# EAGLE design Controller v1 (EAGLE 9.5.0)
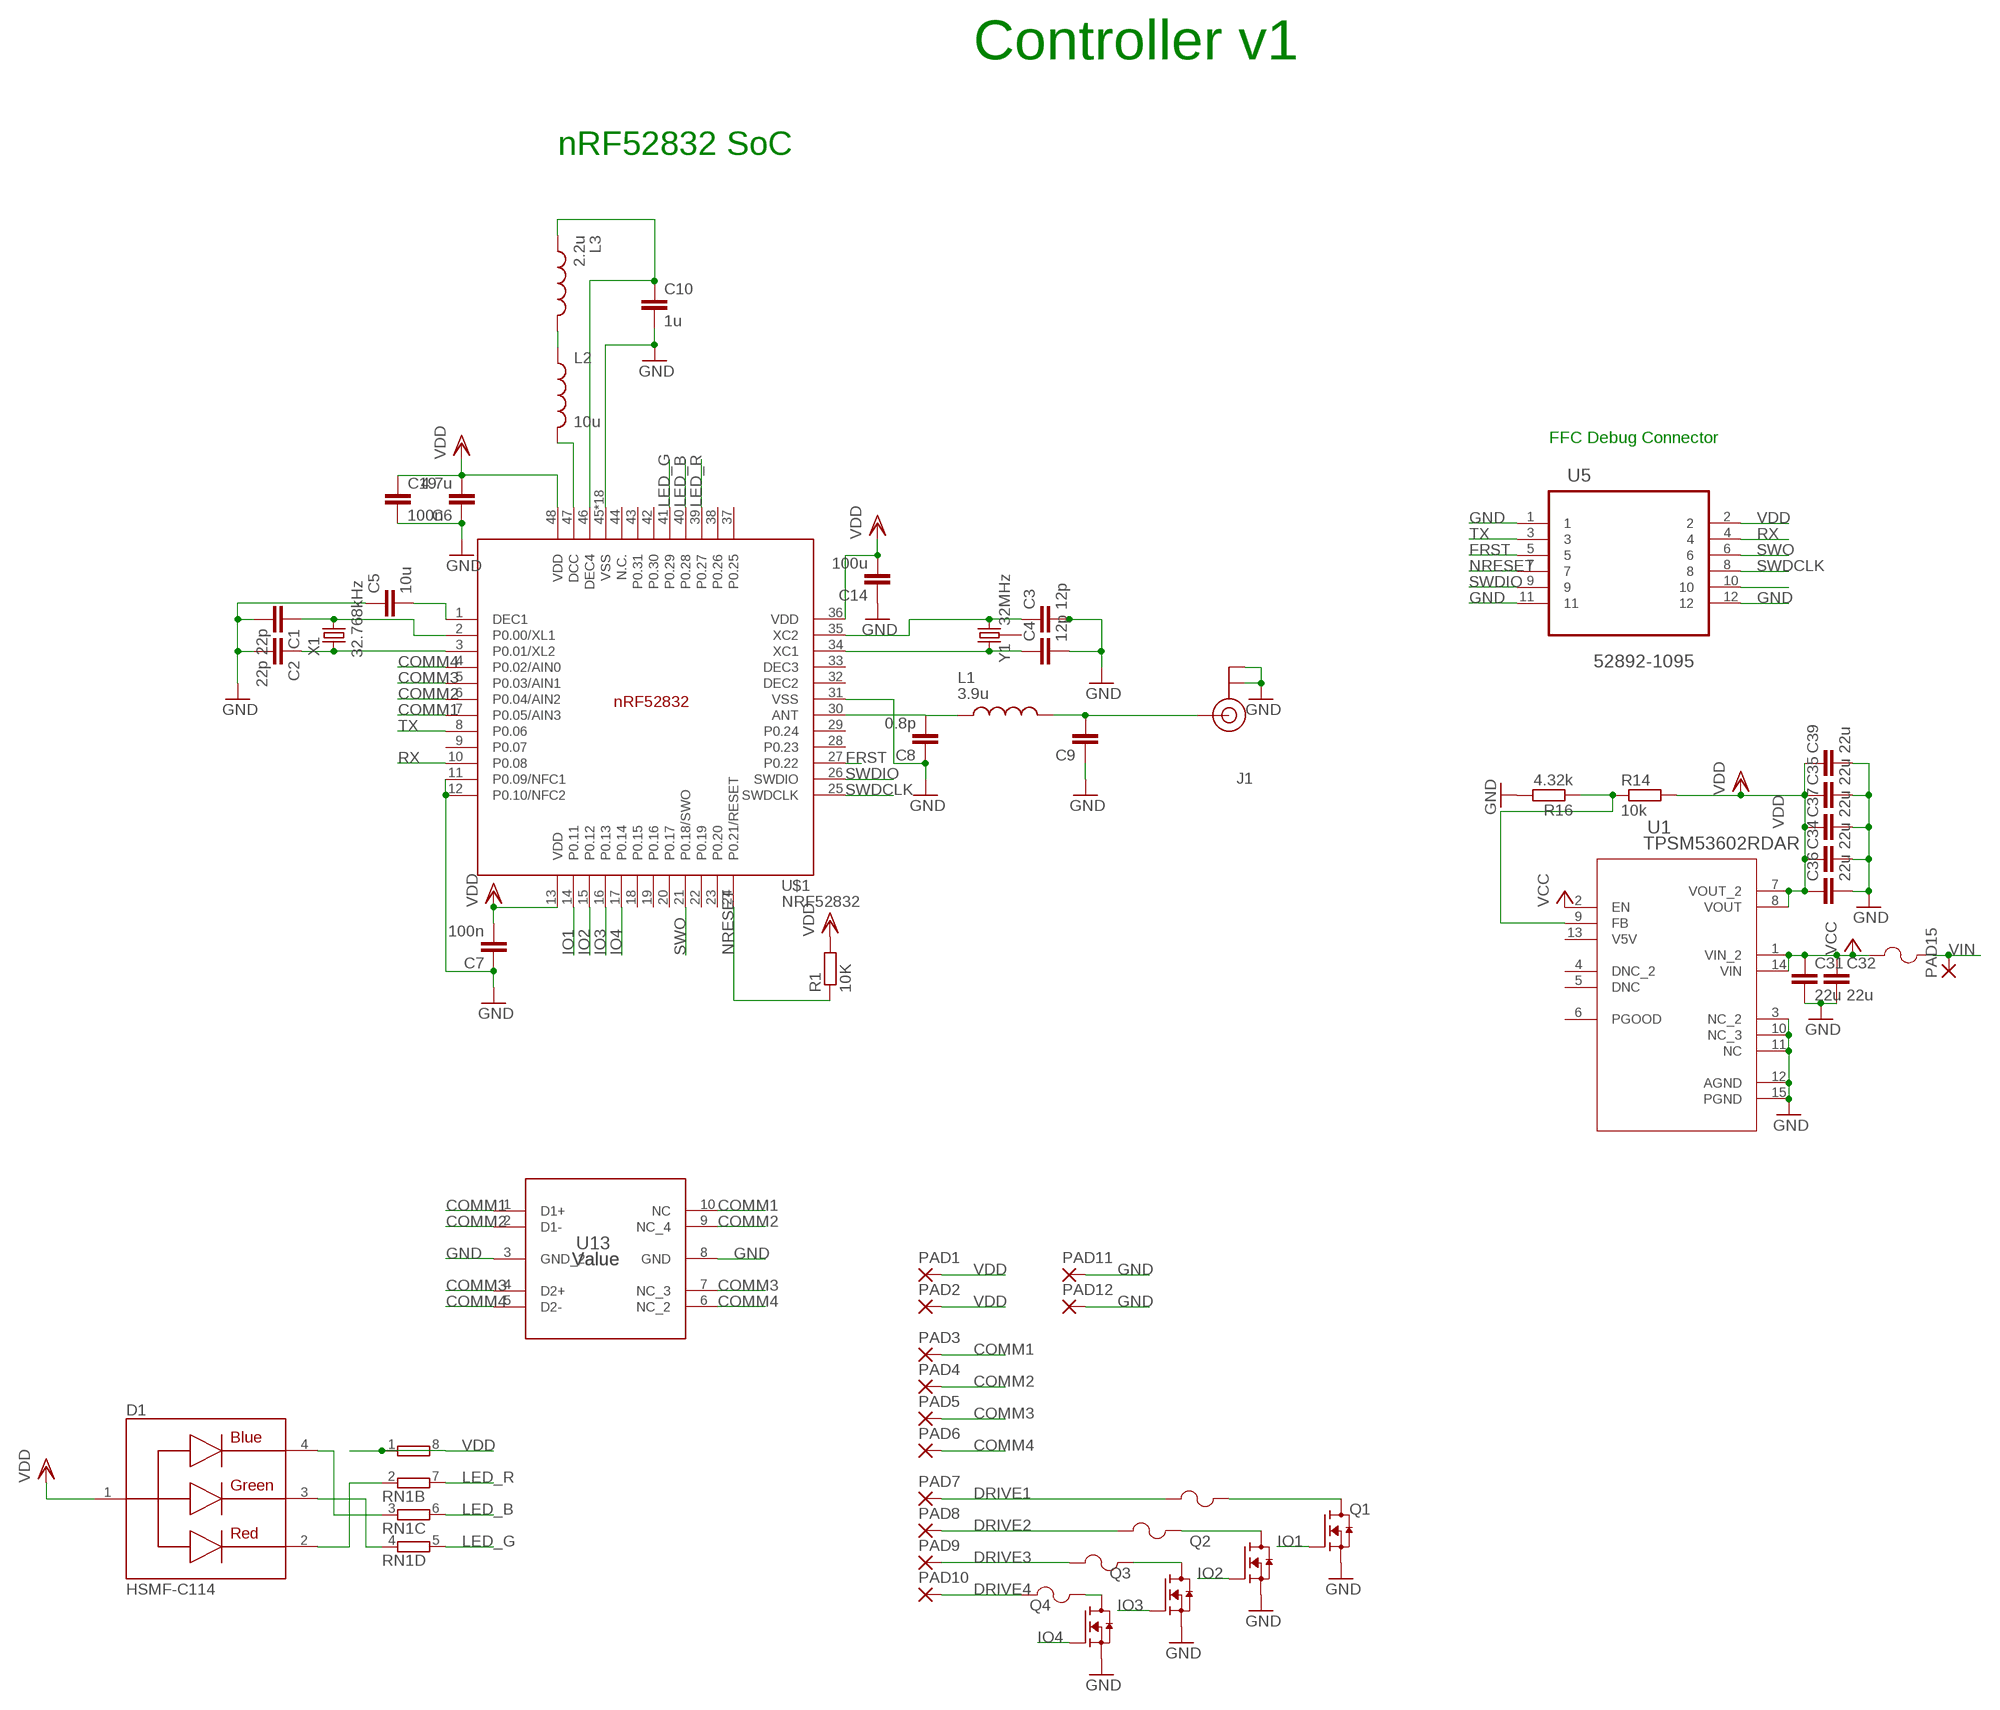
[diagram p0: schematic, sheet 1]

## Parts
C1  22p  CC0402  [C0402]
C2  22p  CC0402  [C0402]
C3  12p  CC0402  [C0402]
C4  12p  CC0402  [C0402]
C5  10u  CC0402  [C0402]
C6  4.7u  CC0402  [C0402]
C7  100n  CC0603R  [C0603R]
C8  0.8p  CC0402  [C0402]
C9  1.2p  CC0402  [C0402]
C10  1u  CC0402  [C0402]
C14  100u  CC0402  [C0402]
C19  100n  CC0402  [C0402]
C31  22u  CC0603R  [C0603R]
C32  22u  CC0603R  [C0603R]
C34  22u  CC0603R  [C0603R]
C35  22u  CC0603R  [C0603R]
C36  22u  CC0603R  [C0603R]
C37  22u  CC0603R  [C0603R]
C39  22u  CC0603R  [C0603R]
D1  HSMF-C114  [DIOSC160X150X35-4N]
F1  1210L050YR1210LSERIES_LTF-L  [1210LSERIES_LTF-L]
F2  1210L050YR1210LSERIES_LTF-L  [1210LSERIES_LTF-L]
F3  1210L050YR1210LSERIES_LTF-L  [1210LSERIES_LTF-L]
F4  1210L050YR1210LSERIES_LTF-L  [1210LSERIES_LTF-L]
F5  1210L050YR1210LSERIES_LTF-L  [1210LSERIES_LTF-L]
J1  U.FL  [U.FL]
L1  3.9u  MHQ0402P7N5JT000  [INDC0402X26N]
L2  10u  INDUCTOR  [L0603]
L3  2.2u  MHQ0402P7N5JT000  [INDC0402X26N]
PAD1  2,54/1,1  [2,54/1,1]
PAD2  2,54/1,1  [2,54/1,1]
PAD3  2,54/1,1  [2,54/1,1]
PAD4  2,54/1,1  [2,54/1,1]
PAD5  2,54/1,1  [2,54/1,1]
PAD6  2,54/1,1  [2,54/1,1]
PAD7  2,54/1,1  [2,54/1,1]
PAD8  2,54/1,1  [2,54/1,1]
PAD9  2,54/1,1  [2,54/1,1]
PAD10  2,54/1,1  [2,54/1,1]
PAD11  2,54/1,1  [2,54/1,1]
PAD12  2,54/1,1  [2,54/1,1]
PAD15  2,54/1,1  [2,54/1,1]
Q1  CSD16301Q2  [TRANS_CSD16301Q2]
Q2  CSD16301Q2  [TRANS_CSD16301Q2]
Q3  CSD16301Q2  [TRANS_CSD16301Q2]
Q4  CSD16301Q2  [TRANS_CSD16301Q2]
R1  10K  RR0402  [R0402]
R14  10k  RR0402  [R0402]
R16  4.32k  RR0402  [R0402]
RN1  4R-N0402ARV341  [4X0402ARV341]
U1  TPSM53602RDAR  [B3QFN15_RDA_TEX]
U5  52892-1095  [MOLEX_52892-1095]
U13  Value  ESD204DQAR  [DQA0010A]
U$1  NRF52832  [QFN40P600X600X90-48_N]
X1  32.768kHz  ABS07-32.768KHZ-T  [ABS07-32.768KHZ-T]
Y1  32MHz  CRYSTAL-26MHZSMD-3.2X2.5  [CRYSTAL-SMD-3.2X2.5MM]

## Nets
COMM1: PAD3.1(P) U13.1(D1+) U13.10(NC) U$1.7(P0.05/AIN3)
COMM2: PAD4.1(P) U13.2(D1-) U13.9(NC_4) U$1.6(P0.04/AIN2)
COMM3: PAD5.1(P) U13.4(D2+) U13.7(NC_3) U$1.5(P0.03/AIN1)
COMM4: PAD6.1(P) U13.5(D2-) U13.6(NC_2) U$1.4(P0.02/AIN0)
DRIVE1: F5.1 PAD7.1(P)
DRIVE2: F4.1 PAD8.1(P)
DRIVE3: F2.1 PAD9.1(P)
DRIVE4: F3.1 PAD10.1(P)
FRST: U5.5 U$1.27(P0.22)
GND: C1.2 C2.2 C3.2 C4.2 C5.1 C6.1 C7.1 C8.1 C9.1 C10.2 C14.1 C19.2 C31.2 C32.2 C34.2 C35.2 C36.2 C37.2 C39.2 J1.1(GND) J1.2(GND) PAD11.1(P) PAD12.1(P) Q1.4(S) Q1.7(S) Q2.4(S) Q2.7(S) Q3.4(S) Q3.7(S) Q4.4(S) Q4.7(S) R16.2 U1.3(NC_2) U1.10(NC_3) U1.11(NC) U1.12(AGND) U1.15(PGND) U5.1 U5.11 U5.12 U13.3(GND_2) U13.8(GND) U$1.11(P0.09/NFC1) U$1.12(P0.10/NFC2) U$1.31(VSS) U$1.45(VSS) U$1.PAD(VSS) U$1.PAD@VIA01(VSS) U$1.PAD@VIA02(VSS) U$1.PAD@VIA03(VSS) U$1.PAD@VIA04(VSS) U$1.PAD@VIA05(VSS) U$1.PAD@VIA06(VSS) U$1.PAD@VIA07(VSS) U$1.PAD@VIA08(VSS) U$1.PAD@VIA09(VSS) U$1.PAD@VIA10(VSS) U$1.PAD@VIA11(VSS) U$1.PAD@VIA12(VSS) U$1.PAD@VIA13(VSS) U$1.PAD@VIA14(VSS) U$1.PAD@VIA15(VSS) U$1.PAD@VIA16(VSS)
IO1: Q1.3(G) U$1.14(P0.11)
IO2: Q2.3(G) U$1.15(P0.12)
IO3: Q3.3(G) U$1.16(P0.13)
IO4: Q4.3(G) U$1.17(P0.14)
LED_B: RN1.6 U$1.40(P0.28)
LED_G: RN1.5 U$1.41(P0.29)
LED_R: RN1.7 U$1.39(P0.27)
N$1: C1.1 U$1.2(P0.00/XL1) X1.2
N$2: C2.1 U$1.3(P0.01/XL2) X1.1
N$3: C3.1 U$1.35(XC2) Y1.3
N$4: C4.1 U$1.34(XC1) Y1.1
N$5: C5.2 U$1.1(DEC1)
N$6: C8.2 L1.1 U$1.30(ANT)
N$7: F2.2 Q3.1(D) Q3.2(D) Q3.5(D) Q3.6(D) Q3.8(D)
N$8: F3.2 Q4.1(D) Q4.2(D) Q4.5(D) Q4.6(D) Q4.8(D)
N$9: L2.2 U$1.47(DCC)
N$10: L2.1 L3.2
N$11: C10.1 L3.1 U$1.46(DEC4)
N$16: D1.2 RN1.2
N$17: D1.3 RN1.4
N$18: D1.4 RN1.3
N$20: F4.2 Q2.1(D) Q2.2(D) Q2.5(D) Q2.6(D) Q2.8(D)
N$21: U5.10
N$22: F5.2 Q1.1(D) Q1.2(D) Q1.5(D) Q1.6(D) Q1.8(D)
N$32: R14.1 R16.1 U1.9(FB)
NRESET: R1.1 U5.7 U$1.24(P0.21/RESET)
RF: C9.2 J1.FEED(SIGNAL) L1.2
RX: U5.4 U$1.10(P0.08)
SWDCLK: U5.8 U$1.25(SWDCLK)
SWDIO: U5.9 U$1.26(SWDIO)
SWO: U5.6 U$1.21(P0.18/SWO)
TX: U5.3 U$1.8(P0.06)
VCC: C31.1 C32.1 F1.1 U1.1(VIN_2) U1.2(EN) U1.14(VIN)
VDD: C6.2 C7.2 C14.2 C19.1 C34.1 C35.1 C36.1 C37.1 C39.1 D1.1 PAD1.1(P) PAD2.1(P) R1.2 R14.2 RN1.1 RN1.8 U1.7(VOUT_2) U1.8(VOUT) U5.2 U$1.13(VDD) U$1.36(VDD) U$1.48(VDD)
VIN: F1.2 PAD15.1(P)
Unconnected: U1.4(DNC_2) U1.5(DNC) U1.6(PGOOD) U1.13(V5V) U$1.9(P0.07) U$1.18(P0.15) U$1.19(P0.16) U$1.20(P0.17) U$1.22(P0.19) U$1.23(P0.20) U$1.28(P0.23) U$1.29(P0.24) U$1.32(DEC2) U$1.33(DEC3) U$1.37(P0.25) U$1.38(P0.26) U$1.42(P0.30) U$1.43(P0.31) U$1.44(N.C.) Y1.2 Y1.4

## Notes on the sheet
- Controller v1
- nRF52832 SoC
- FFC Debug Connector

## Library data of the parts
C1-C6 C8-C10 C14 C19 = eagle-ltspice:C: CAPACITOR, European symbol; SPICEMODEL: NONE; SPICEPREFIX: C
C7 C31 C32 C34-C37 C39 = eagle-ltspice:C: CAPACITOR, European symbol
D1 = HSMF-C114:HSMF-C114: LED Tri-Color Blue/Green/Red 468nm/523nm/637nm 4-Pin Chip LED T/R; AVAILABILITY: Unavailable; DESCRIPTION: LED RGB DIFFUSED CHIP SMD; MF: Broadcom Limited; MP: HSMF-C114; PACKAGE: 0606 Broadcom; PRICE: None
F1-F5 = 1210 FUSE:1210L050YR; BUILT_BY: EMA_UL_Team; MANUFACTURER_PART_NUMBER: 1210L050YR; SOURCELIBRARY: LittleFuse_2015-04-13; VENDOR: Littelfuse Inc
J1 = SparkFun-Connectors:U.FL: SMD Antenna Connector - U.FL 2mm height, 3.0mm x 3.0mm receptacle size. SparkFun Products: SparkFun WiFi Shield - ESP8266 <https://www.sparkfun.com/products/13287> SparkFun ESP8266 Thing <https://www.sparkfun.com/products/13231> SparkFun MiniGen - Pro Mini Signal Generator Shield <https://www.sparkfun.com/products/11420>; PROD_ID: CONN-09193; SF_ID: WRL-09144
L1 L3 = MHQ0402P7N5JT000:MHQ0402P7N5JT000: 221 NH 5% GOLD TERMINAL; AVAILABILITY: Unavailable; DESCRIPTION: FIXED IND 7.5NH 200MA 1.2 OHM; MF: TDK; MP: MHQ0402P7N5JT000; PACKAGE: 0402 TDK; PRICE: None
L2 = BeagleBone_Blue_R3:INDUCTOR: Inductors Basic Inductor/Choke - 0603 and 1206. Footprints are not proven and vary greatly between part numbers. SRN6045- 33uH, 20% 1.4A
PAD1-PAD12 PAD15 = wirepad:2,54/1,1: THROUGH-HOLE PAD
Q1-Q4 = CSD16301Q2:CSD16301Q2: N-Channel 25V 5A (Tc) 2.3W (Ta) Surface Mount 6-SON Check prices <https://snapeda.com/parts/CSD16301Q2/Texas%20Instruments/view-part/?ref=eda>; ARROW_ELECTRONICS-PURCHASE-URL: https://snapeda.com/shop?store=Arrow+Electronics&id=49184; AVAILABILITY: Good; DESCRIPTION: 25V, N ch NexFET MOSFET, single SON2x2, 29mOhm 6-WSON -55 to 150; DIGIKEY-PURCHASE-URL: https://snapeda.com/shop?store=DigiKey&id=49184; MF: Texas Instruments; MOUSER-PURCHASE-URL: https://snapeda.com/shop?store=Mouser&id=49184; MP: CSD16301Q2; PACKAGE: WSON-6 Texas Instruments; PRICE: None; TEXAS_INSTRUMENTS-PURCHASE-URL: https://snapeda.com/shop?store=Texas+Instruments&id=49184
R1 R14 R16 = eagle-ltspice:R: RESISTOR, European symbol; SPICEMODEL: NONE; SPICEPREFIX: R
RN1 = resistor-dil:4R-N: Array Chip Resistor Source: RS Component / Phycomp; OC_FARNELL: unknown; OC_NEWARK: unknown
U1 = TPSM53602:TPSM53602RDAR; BUILT_BY: EMA_Cory; COPYRIGHT: Copyright (C) 2018 Accelerated Designs. All rights reserved; DATASHEET: https://www.ti.com/lit/ds/symlink/tpsm53602.pdf?ts=1593032137197&ref_url=https%253A%252F%252Fwww.ti.com%252Fstore%252Fti%252Fen%252Fp%252Fproduct%252F%253Fp%253DTPSM53602RDAR; MANUFACTURER_PART_NUMBER: TPSM53602RDAR; SOURCELIBRARY: TI_2020-06-27; VENDOR: Texas Instruments
U5 = 52892-1095:52892-1095: CONNECTOR, FPC, ZIF, 0.50MM, 10 WAY; AVAILABILITY: Unavailable; DESCRIPTION: Socket, r/a, Fpc, Zif, Smt, 10way; MF: Molex; MP: 52892-1095; PACKAGE: None; PRICE: None
U13 = ESD204DQAR:ESD204DQAR; MANUFACTURER: Texas Instruments; PARTNUMBER: ESD204DQAR; REFDES: RefDes; TYPE: TYPE
U$1 = Nordic_nRF:NRF52832: nRF52832 Features Single chip, highly flexible, 2.4 GHz multi-protocol SoC 32-bit ARM Cortex-M4F Processor 1.7v to 3.6v operation 512kB flash + 64kB RAM Supports concurrent Bluetooth Smart/ANT protocol operation On-chip NFC tag for Out-of-Band (OOB) pairing Up to +4dBm output power -96dBm sensitivity, Bluetooth Smart Thread safe and run-time protected Event driven API On air compatible with nRF24L and nRF24AP series 2 data rates (2Mbps/1Mbps) PPI - maximum flexibility for power-efficient applications and code simplification Automated power management system with automatic power management of each peripheral Configurable I/O mapping for analog and digital I/O 3 x Master/Slave SPI 2 x Two-wire interface (I²C) UART (RTS/CTS) 3 x PWM AES HW encryption Real Time Counter (RTC) Digital microphone interface (PDM) On-chip balun Applications Internet of Things (IoT) Wearables SmartHome sensors Connected white goods Computer peripherals Voice-command smart remotes A4WP ‘Rezence’ wireless charging Beacons Sports and fitness sensors and hubs Connected health products Smart watches RC Toys Interactive games Building automation and sensor networks
X1 = Crystals:ABS07-32.768KHZ-T: CRYSTAL 32.7680KHZ 12.5PF SMD Manufacturer's datasheet <https://abracon.com/Resonators/ABS07.pdf>; CREATED_BY: PCBLayout.com; DIGIKEY_PART_NUMBER: 535-9542-2-ND; MANUFACTURER: Abracon LLC; MPN: ABS07-32.768KHZ-T; PACKAGE: SMD-2
Y1 = SparkFun-Clocks:CRYSTAL-26MHZ: 26MHz Crystal w/ Ground Pin Digikey Example <http://www.digikey.com/product-detail/en/epson/TSX-3225%2026.0000MF09Z-AC3/SER3627CT-ND/1802878> Frequency: 26MHz Frequency Stability: ±9ppm Frequency Tolerance: ±10ppm Load Capacitance: 9pF SparkFun Products: SparkFun ESP32 Thing <https://www.sparkfun.com/products/13907> SparkFun ESP8266 Thing Dev Board <https://www.sparkfun.com/products/13711>; PROD_ID: XTAL-12454

## Net classes
1 RF: clearance 0.4 mm

## Board
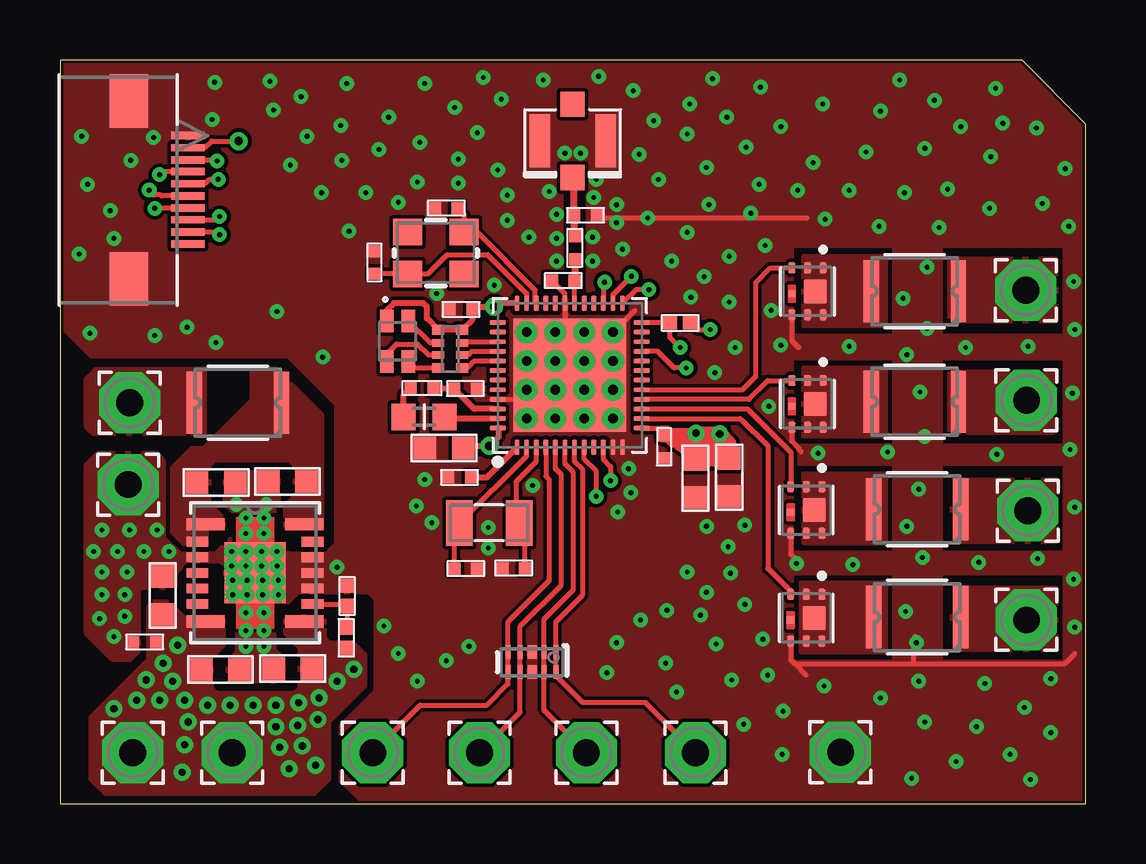
[diagram p1: board, top side]
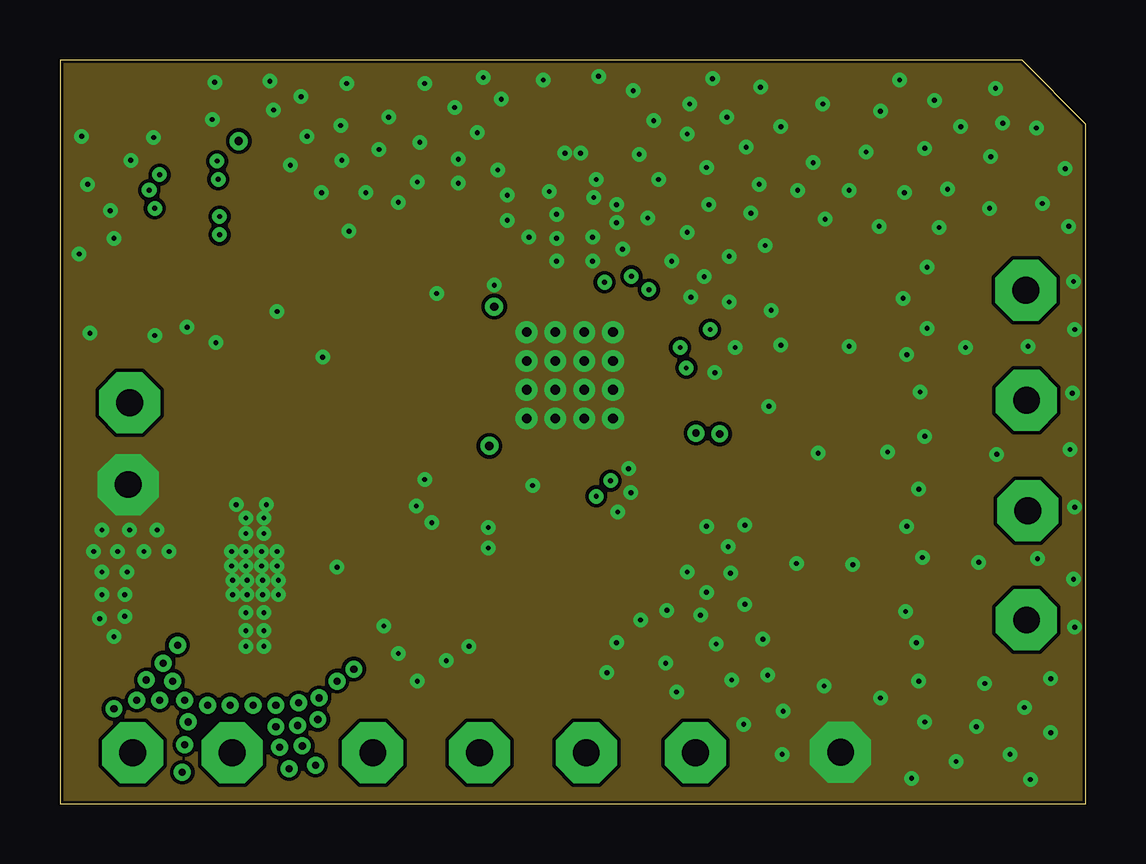
[diagram p2: board, inner layer Route2]
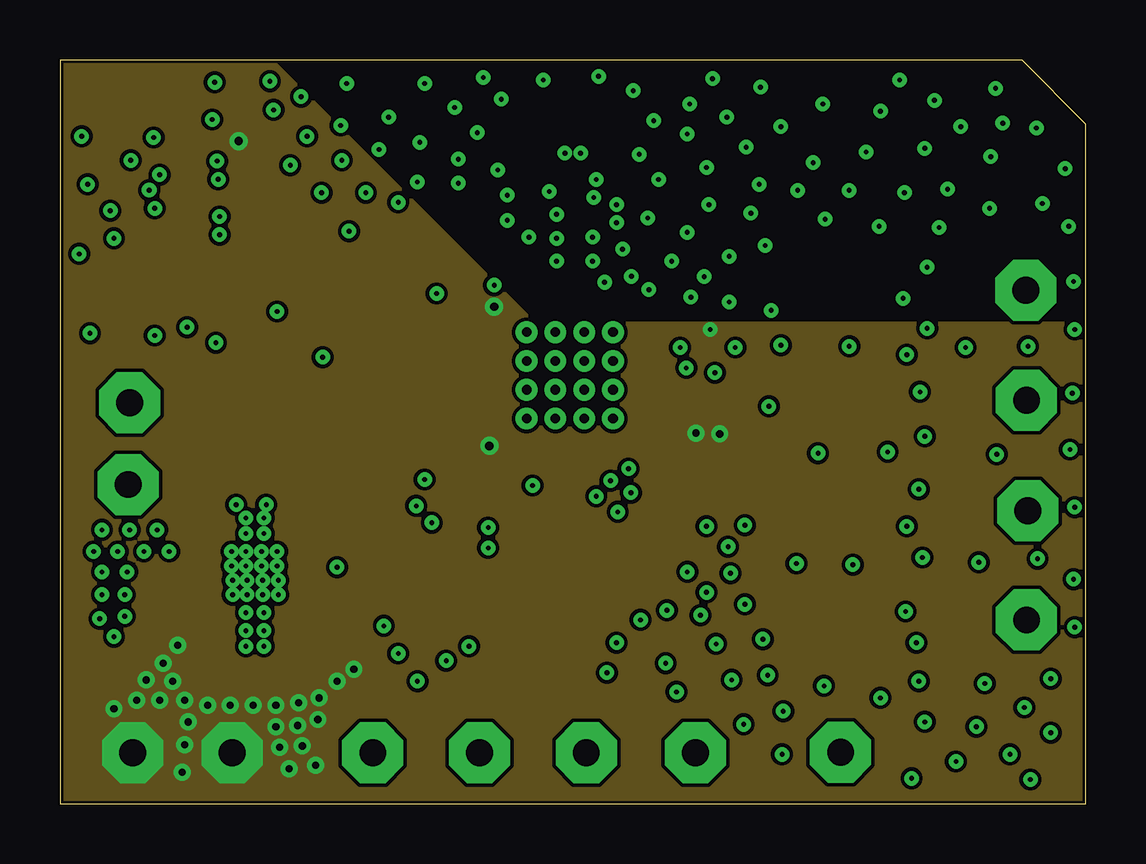
[diagram p3: board, inner layer Route15]
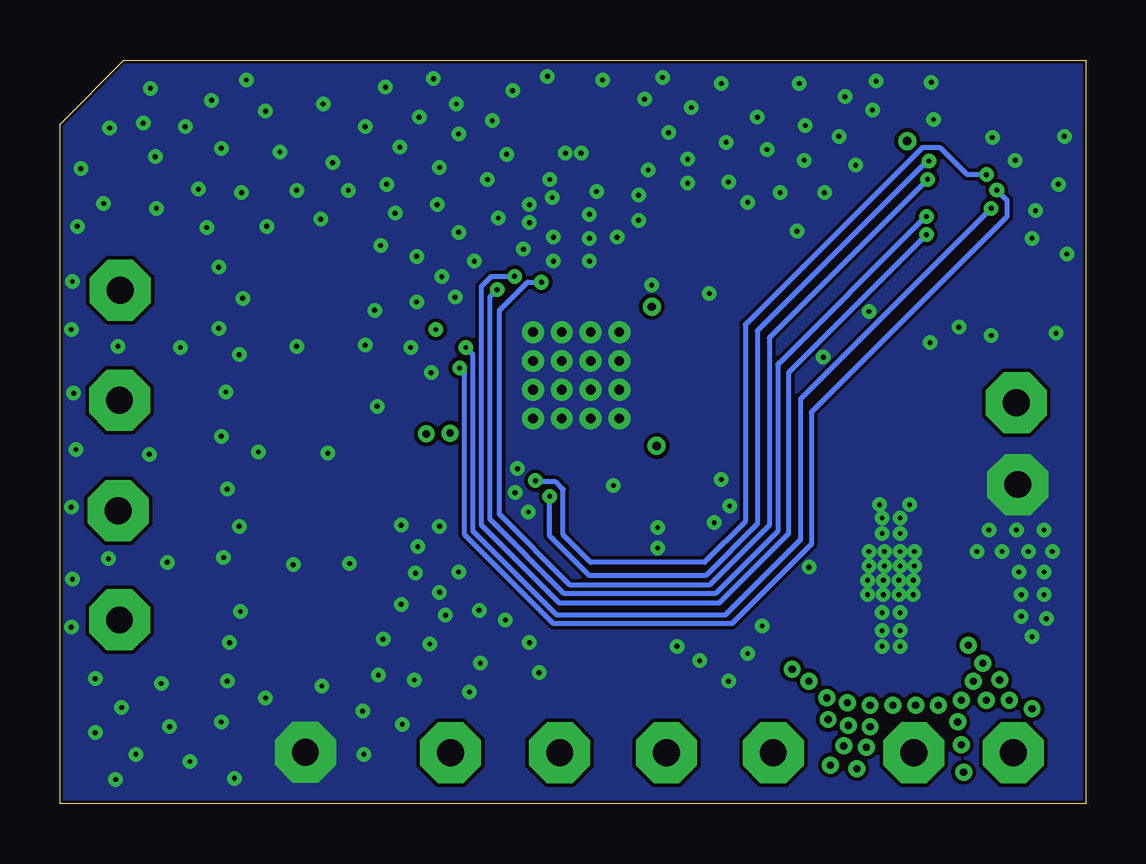
[diagram p4: board, bottom side, seen from below]

Size 42.77 x 30.98 mm. Coordinates in mm from the lower left corner, seen from the top.
Outline: 0,0 42.77,0 42.77,28.31 40.11,30.98 0,30.98 0,0
Copper layers (1+2*15+16): Top 0.035mm / dielectric 1.5mm / Route2 0.035mm / dielectric 0.15mm / Route15 0.035mm / dielectric 0.2mm / Bottom 0.035mm
Design rules "default *": minimum track width 5mil, minimum drill 0.2mm, track to track 6mil, track to pad 6mil, pad to pad 6mil, via to via 6mil, smd to smd 6mil, copper to edge 5mil, drill to drill 6mil, minimum pad ring 10mil, minimum via ring 8mil, stop-mask expansion 0mil, vias tented up to drill 40mil, thermal gap 0mil
tRestrict: area 20.1,21.1 to 21.1,22.1; 2 lines

### Footprints (pad centres in the part's own frame; a part is rotated, then mirrored left to right if it is on the bottom)
C0402 = smd 0.5 x 0.5: 1 -0.475,0; 2 0.475,0
C0603R = smd 0.95 x 0.95: 1 -0.85,0; 2 0.75,0
DIOSC160X150X35-4N = smd 0.94 x 0.57: 1 -0.845,-0.45; 2 -0.845,0.45; 3 0.845,0.45; 4 0.845,-0.45
1210LSERIES_LTF-L = smd 0.635 x 2.591: 1 -1.816,0; 2 1.816,0
U.FL = smd 2.2 x 0.85: 1 0,1.375; 2 0,-1.375 | smd 1.05 x 1: FEED 1.525,0; NC -1.525,0
INDC0402X26N = smd 0.5 x 0.5: 1 -0.732,0; 2 0.232,0
L0603 = smd 1 x 1.1: 1 -0.85,0; 2 0.85,0
2,54/1,1 = drill 1.118 pad 2.54 octagon: 1 0,0
TRANS_CSD16301Q2 = smd 0.45 x 0.3: 1 -0.975,0.65; 2 -0.975,0; 3 -0.975,-0.65; 4 0.975,-0.65; 5 0.975,0; 6 0.975,0.65 | smd 0.3 x 0.3: 7 0.095,-0.65 | smd 1 x 0.95: 8 0,0.325
R0402 = smd 0.6 x 0.55: 1 -0.425,0; 2 0.425,0
4X0402ARV341 = smd 0.4 x 0.5: 1 -0.8,-0.5; 4 0.8,-0.5; 5 0.8,0.5; 8 -0.8,0.5 | smd 0.3 x 0.5: 2 -0.25,-0.5; 3 0.25,-0.5; 6 0.25,0.5; 7 -0.25,0.5
B3QFN15_RDA_TEX = smd 1.6 x 0.508: 1 -2.057,2.025; 7 -2.057,-2.025; 8 2.057,-2.025; 14 2.057,2.025 | smd 0.914 x 0.406: 2 -2.4,1.3; 3 -2.4,0.65; 4 -2.4,0; 5 -2.4,-0.65; 6 -2.4,-1.3; 9 2.4,-1.3; 10 2.4,-0.65; 11 2.4,0; 12 2.4,0.65; 13 2.4,1.3 | smd 2.54 x 2.54: 15 0,0
MOLEX_52892-1095 = smd 0.305 x 1.397: 1 2.261,2.896; 2 1.753,2.896; 3 1.245,2.896; 4 0.762,2.896; 5 0.254,2.896; 6 -0.254,2.896; 7 -0.762,2.896; 8 -1.245,2.896; 9 -1.753,2.896; 10 -2.261,2.896 | smd 2.21 x 1.6: 11 -3.702,5.359; 12 3.702,5.359
DQA0010A = smd 0.565 x 0.2: 1 -0.417,1; 2 -0.417,0.5; 4 -0.417,-0.5; 5 -0.417,-1; 6 0.417,-1; 7 0.417,-0.5; 9 0.417,0.5; 10 0.417,1 | smd 0.565 x 0.4: 3 -0.417,0; 8 0.417,0
QFN40P600X600X90-48_N = smd 0.65 x 0.2: 1 -3,2.2; 2 -3,1.8; 3 -3,1.4; 4 -3,1; 5 -3,0.6; 6 -3,0.2; 7 -3,-0.2; 8 -3,-0.6; 9 -3,-1; 10 -3,-1.4; 11 -3,-1.8; 12 -3,-2.2; 25 3,-2.2; 26 3,-1.8; 27 3,-1.4; 28 3,-1; 29 3,-0.6; 30 3,-0.2; 31 3,0.2; 32 3,0.6; 33 3,1; 34 3,1.4; 35 3,1.8; 36 3,2.2 | smd 0.2 x 0.65: 13 -2.2,-3; 14 -1.8,-3; 15 -1.4,-3; 16 -1,-3; 17 -0.6,-3; 18 -0.2,-3; 19 0.2,-3; 20 0.6,-3; 21 1,-3; 22 1.4,-3; 23 1.8,-3; 24 2.2,-3; 37 2.2,3; 38 1.8,3; 39 1.4,3; 40 1,3; 41 0.6,3; 42 0.2,3; 43 -0.2,3; 44 -0.6,3; 45 -1,3; 46 -1.4,3; 47 -1.8,3; 48 -2.2,3 | smd 4.7 x 4.7: PAD 0,0 | drill 0.4: PAD@VIA01 -1.8,1.8; PAD@VIA02 -1.8,0.6; PAD@VIA03 -1.8,-0.6; PAD@VIA04 -1.8,-1.8; PAD@VIA05 -0.6,1.8; PAD@VIA06 -0.6,0.6; PAD@VIA07 -0.6,-0.6; PAD@VIA08 -0.6,-1.8; PAD@VIA09 0.6,1.8; PAD@VIA10 0.6,0.6; PAD@VIA11 0.6,-0.6; PAD@VIA12 0.6,-1.8; PAD@VIA13 1.8,1.8; PAD@VIA14 1.8,0.6; PAD@VIA15 1.8,-0.6; PAD@VIA16 1.8,-1.8
ABS07-32.768KHZ-T = smd 1.1 x 1.9: 1 -1.25,0; 2 1.25,0
CRYSTAL-SMD-3.2X2.5MM = smd 1.2 x 1.1: 1 -1.175,-0.875; 2 1.175,-0.875; 3 1.175,0.875; 4 -1.175,0.875

### Placement (x,y rotation side)
C1  16.92,9.79 0 top
C2  18.92,9.81 180 top
C3  13.11,22.54 90 top
C4  16.1,24.81 180 top
C5  16.66,13.59 0 top
C6  16.72,20.59 0 top
C7  4.28,8.62 270 top
C8  20.98,21.79 0 top
C9  21.91,24.51 180 top
C10  16.9,17.29 0 top
C14  3.53,6.73 0 top
C19  25.18,14.86 270 top
C31  9.43,13.42 180 top
C32  6.56,13.38 0 top
C34  9.65,5.62 180 top
C35  6.74,5.58 0 top
C36  27.89,13.54 270 top
C37  26.49,13.5 270 top
C39  15.96,14.81 180 top
D1  14.07,19.26 270 top
F1  7.42,16.7 180 top
F2  35.63,16.74 180 top
F3  35.63,21.35 180 top
F4  35.73,12.26 180 top
F5  35.73,7.77 180 top
J1  21.37,27.61 270 top
L1  21.46,23.4 90 top
L2  15.18,16.11 0 top
L3  14.84,17.31 180 top
PAD1  7.18,2.12 0 top
PAD2  3.03,2.12 0 top
PAD3  26.49,2.12 0 top
PAD4  21.94,2.12 0 top
PAD5  17.49,2.12 0 top
PAD6  13.04,2.12 0 top
PAD7  40.29,7.65 0 top
PAD8  40.34,12.2 0 top
PAD9  40.29,16.8 0 top
PAD10  40.26,21.39 0 top
PAD11  32.54,2.14 0 top
PAD12  2.84,13.29 0 top
PAD15  2.9,16.7 0 top
Q1  31.11,7.74 270 top
Q2  31.11,12.23 270 top
Q3  31.16,16.65 270 top
Q4  31.16,21.34 270 top
R1  25.85,20.03 0 top
R14  11.93,6.91 270 top
R16  11.97,8.65 90 top
RN1  16.27,18.94 270 top
U1  8.13,9.61 0 top
U5  8.23,25.57 90 top
U13  19.68,5.89 270 top
U$1  21.25,17.84 90 top
X1  17.89,11.69 180 top
Y1  15.67,22.94 180 top

### Tracks (layer width: path | path; a pad name or v marks a point on that pad's centre or on a via)
COMM1
  Top 0.2: PAD3.1 24.41,4.2 21.8,4.2 20.68,5.32 U13.10 U13.1 20.68,7.58 21.8,8.7 21.8,13.9 21.45,14.25 U$1.7
COMM2
  Top 0.2: PAD4.1 20.18,3.88 U13.9 U13.2 20.18,7.68 21.4,8.9 21.4,13.8 21.05,14.15 U$1.6
COMM3
  Top 0.2: PAD5.1 19.18,3.81 U13.7 19.18,6 U13.4 19.18,7.38 20.9,9.1 20.9,13.7 20.65,13.95 U$1.5
COMM4
  Top 0.2: PAD6.1 15.02,4.1 17.8,4.1 18.68,4.98 U13.6 U13.5 18.68,7.58 20.4,9.3 20.4,13.5 20.25,13.65 20.25,14.7 U$1.4
DRIVE1
  pour Top: 37.2,9 41.5,9 41.5,6.4 37.4,6.4 37.2,6.6
DRIVE2
  pour Top: 37.2,13.5 41.5,13.5 41.5,10.9 37.3,10.9 37.2,11
DRIVE3
  pour Top: 37.1,18 41.4,18 41.4,15.45 37.15,15.45 37.1,15.5
DRIVE4
  pour Top: 37.1,22.7 41.5,22.7 41.5,20.1 37.2,20.1 37.1,20.2
FRST  (via drill 0.2)
  Top 0.2: U5.5 6.04,25.83 6.22,26.01 v6.6,26.01 | v22.7,21.72 22.7,21.52 22.65,21.47 U$1.27
  Bottom 0.2: v6.6,26.01 13.2,19.41 13.2,11.6 15.7,9.1 21.5,9.1 24.45,12.05 24.45,20.55 23.28,21.72 v22.7,21.72
GND  (via drill 0.2)
  Top 0.2: Q4.4 30.51,19.29 30.8,19 | Q3.4 30.51,15.09 30.81,14.79 30.81,14.74 30.9,14.65 | Q2.4 30.46,10.39 30.8,10.05 | C9.1 22.5,24.4 31.15,24.4 | Q1.4 30.46,5.99 30.62,5.83 | 30.62,5.83 31.1,5.35 | 30.62,5.83 35.6,5.83 | 35.6,5.83 41.88,5.83 42.3,6.25 | 35.6,5.83 35.6,6.9 35.65,6.95 | U$1.45 19.56,16.84 19.7,16.7 19.7,16.99 U$1.PAD@VIA05 | U$1.31 21.05,20.04 U$1.PAD@VIA14 | U$1.PAD 23.95,20.54 23.95,20.55
  Top 0.203: U$1.31 21.05,21.25 C8.1
  other vias: 9.1,8.7 8.45,8.7 7.8,8.7 7.2,8.7 9.05,10.5 8.4,10.5 7.75,10.5 7.15,10.5 9.05,9.9 8.4,9.9 7.75,9.9 7.15,9.9 9.1,9.3 8.45,9.3 7.8,9.3 7.2,9.3 18.25,26.4 18.65,24.3 18.65,25.35 24.15,27.05 2.4,10.5 1.4,10.5 16.6,25.85 14.1,6.25 7.75,7.95 1.75,9.65 4.55,10.5 4.05,11.4 2.25,6.95 2.7,7.8 1.75,8.7 3.5,10.5 8.5,7.95 1.65,7.7 2.7,8.7 2.8,9.65 18.4,29.35 27.8,28.6 1.25,19.6 6.45,30.05 14.9,25.9 11.95,30 20.15,30.15 2.25,23.55 1.75,11.4 14.9,5.1 16.6,26.85 26.25,29.15 17.4,27.95 23.2,6.7 25.25,5.85 26.15,23.8 11.55,9.85 12.75,25.45 24.5,24.4 24.75,28.45 22.45,30.3 12.05,23.85 8.75,30.1 9.6,26.6 24.95,26 16.45,29 17.65,30.25 6.35,28.5 2.9,11.4 23.45,23.1 26.95,26.5 8.9,28.9 16.1,5.95 17.05,6.55 26.15,27.9 15,27.55 13.5,7.4 19.55,23.6 22.8,5.45 25.3,8.05 26.85,21.95 2.95,26.8 0.8,22.9 0.9,27.8 6.5,19.2 10.3,27.8 2.1,24.7 1.15,25.8 27.05,24.95 10.9,25.45 5.3,19.85 11.75,26.8 13.7,28.6 10.05,29.45 15.2,30 3.9,27.75 23.9,29.7 13.3,27.25 11.7,28.25 3.95,19.5 7.75,7.2 8.5,7.2 7.75,6.55 8.5,6.55 7.35,12.45 8.6,12.45 7.75,11.9 8.5,11.9 7.75,11.25 8.5,11.25 17.85,10.65 27.9,22.8 35.3,18.7 25.7,4.65 27.85,10.7 32.9,19.05 27.9,20.9 42.25,21.75 31.4,26.7 30.1,2.05 38.8,26.95 36.65,24 23.7,13.95 41.9,26.45 23.8,12.95 42.05,24.05 38.75,24.8 17.85,11.5 26.7,7.85 29.65,20.55 29.55,16.55 14.85,12.4 24.2,7.65 35.15,21.05 28.6,27.35 40.35,19.05 31.8,29.15 36.15,22.35 35,30.15 28.8,24.6 39,29.8 27.35,6.65 26.95,11.55 37.55,28.2 28.55,11.6 15.5,11.7 27.95,9.6 28.55,8.3 35.85,17.15 23.25,12.15 26.95,8.8 26.15,9.65 34.2,4.4 31.85,4.9 29.4,23.25 14.1,25.05 28,5.15 35.8,5.1 37.35,1.75 39.3,28.35 30.75,25.55 31.6,14.6 34.5,14.65 28.5,3.3 27.3,17.95 30.15,3.85 39.05,14.55 28.15,19 37.75,19 36.05,3.4 36.15,19.8 15.2,13.5 27.2,30.2 36.05,27.3 30.05,19.1 34.15,24.05 35.2,25.45 38.55,5 40.75,10.2 19.7,13.25 40.2,4 42.2,17.1 30.7,10 42.3,7.35 33.05,9.95 38.3,10.05 42.25,9.35 35.25,8 30.05,28.2 18.1,21.6 36.45,29.3 34.2,28.85 15.7,21.25 29.2,29.85 25.5,22.6 41.3,5.2 35.95,10.25 26.3,21.1 38.2,3.2 42.3,12.35 36.05,15.3 35.3,11.55 35.8,13.1 42.1,14.75 29.3,6.85 31.9,24.35 10.95,18.6 29.15,25.8 33.6,27.15 42.3,19.75 9.05,20.5 37,25.6 32.9,25.55 22.2,23.6 22.2,22.6 20.4,25.5 20.7,22.6 22.35,26 22.25,25.25 20.7,24.55 20.7,23.55 21.05,27.1 21.7,27.1 23.2,24.2 23.2,24.95 29.5,5.35 40.7,28.15 40.45,1 35.5,1.05 40.95,25 41.3,2.95 39.6,2.05 35.7,6.7
  pour Top: 7,5.1 7,5.9 7.4,6.3 7.4,7.3 7.4,8.3 6.9,8.3 6.9,9.9 6.7,10.1 5.8,10.1 5.3,10.1 5.1,9.9 4.8,9.6 4.8,9 3.4,9 1.5,9 1.2,9.3 1.1,9.4 1.1,14 1.1,14.1 1.6,14.6 4,14.6 4.2,14.4 4.3,14.3 4.3,11.1 5,10.4 5.5,10.4 6.5,10.4 6.8,10.7 7.3,11.2 7.3,11.8 7.3,12.1 6.9,12.5 6.9,13.8 9.1,13.8 9.1,12.6 8.9,12.4 8.9,11 9,10.9 9.5,10.4 10.6,10.4 12.3,10.4 12.9,9.8 12.9,8.8 9.9,8.8 9.4,8.3 9,8.3 8.9,8.2 8.9,7.3 8.9,6.4 9.3,6 9.3,5.1
  pour Top: 12.9,8.8 13.15,8.55 13.15,5.6 13.15,4.65 12.65,4.15 11.7,3.2 11.7,2.6 11.7,1 12.3,0.4 12.8,-0.1 30.15,-0.1 30.5,0.25 30.5,6.65 30.5,30.95 0.05,30.95 0,30.9 0,19.95 1.25,18.7 1.3,18.65 9.5,18.65 11.5,16.65 11.5,14.85 11.5,10.8 11.2,10.5
  pour Top: 30.5,30.9 42.75,30.9 42.75,23.6 42.4,23.25 30.35,23.25 30.35,30.75
  pour Top: 30.5,18.55 30.5,19.5 42.7,19.5 42.7,18.55
  pour Top: 30.45,0 30.45,5.9 42.65,5.9 42.65,0
  pour Top: 30.5,9.6 30.5,10.45 42.7,10.45 42.7,9.6
  pour Top: 30.45,14.15 30.45,14.9 42.65,14.9 42.65,14.15
  pour Top: 41.9,5.9 41.9,23.5 42.8,23.5 42.8,5.9
  pour Top: 34.8,5.75 34.8,23.35 36.7,23.35 36.7,5.75
  pour Top: 3.25,9.1 3.25,6.35 2.9,6 2.2,6 1.1,7.1 1.1,9.4 2.95,9.4
  pour Route2: -0.65,32.65 43.6,32.65 43.6,-0.7 -0.65,-0.7
  pour Bottom: -0.7,31.65 43.55,31.65 43.55,-0.95 -0.7,-0.95
IO1
  Top 0.2: U$1.14 28.36,16.04 29.5,14.9 29.5,9.8 30.46,8.84 Q1.3
IO2
  Top 0.2: U$1.15 28.66,16.44 30.46,14.64 Q2.3
IO3
  Top 0.2: Q3.3 29.51,17.62 28.73,16.84 U$1.16
IO4
  Top 0.2: U$1.17 28.44,17.24 29,17.8 29,21.7 29.61,22.32 Q4.3
LED_B
  Top 0.2: RN1.6 17.02,18.69 17.18,18.84 U$1.40
LED_G
  Top 0.2: RN1.5 16.82,18.19 17.02,18.19 17.28,18.44 U$1.41
LED_R
  Top 0.2: RN1.7 16.82,19.24 U$1.39
N$1
  Top 0.2: U$1.2 19.45,14.48 16.66,11.69 X1.2 16.45,11.49 C1.1
N$2
  Top 0.2: U$1.3 19.85,14.25 19,13.4 19,11.83 X1.1 19.39,11.44 C2.1
N$3
  Top 0.2: C3.1 Y1.3 15.34,22.07 16.14,22.87 17.83,22.87 19.45,21.25 U$1.35
N$4
  Top 0.2: C4.1 16.84,24.54 Y1.1 17.38,23.82 19.8,21.4 19.8,20.89 U$1.34
N$5
  Top 0.254: C5.2 17.8,13.59 U$1.1
N$6
  Top 0.203: U$1.30 C8.2
  Top 0.3: C8.2 L1.1
N$7
  pour Top: 31,18.15 34.4,18.15 34.4,15.3 31,15.3
N$8
  pour Top: 31,22.8 34.4,22.8 34.4,19.9 31,19.9
N$9
  Top 0.254: U$1.47 16.1,16.04 L2.2
N$10
  Top 0.254: L2.1 14.33,17.03 L3.2
N$11
  Top 0.2: U$1.46 18.11,16.44 18.1,16.45
  Top 0.254: L3.1 16.41,17.31 C10.1 17.27,16.45 18.1,16.45
N$16
  Top 0.2: RN1.2 15.44,19.19 D1.2
N$17
  Top 0.2: RN1.4 14.79,18.14 D1.3
N$18
  Top 0.2: RN1.3 15.36,18.69 14.91,19.14 14.03,19.14 13.6,18.71 13.6,18.43 D1.4
N$20
  pour Top: 31,13.75 34.4,13.75 34.4,10.85 31,10.85
N$22
  pour Top: 30.9,9.2 34.4,9.2 34.4,6.3 30.9,6.3
N$32
  Top 0.2: U1.9 11.88,8.31 R16.1 11.97,7.38 R14.1
NRESET  (via drill 0.2)
  Top 0.2: U$1.24 25.41,20.04 R1.1 25.43,19.43 v25.85,19 | U5.7 v3.96,24.81 v3.95,24.8
  Bottom 0.2: v3.95,24.8 11.9,16.85 11.9,11 15.05,7.85 22.05,7.85 25.55,11.35 25.55,18.7 v25.85,19
RF
  Top 0.3: L1.2 21.43,23.66 C9.2 21.43,26.02 J1.FEED
RX  (via drill 0.2)
  Top 0.2: U5.4 4.28,26.33 v4.15,26.2 | v22.95,13.45 v22.96,13.46 22.96,14.04 22.65,14.35 U$1.10
  Bottom 0.2: v4.15,26.2 4.95,26.2 6.07,27.32 6.83,27.32 14.2,19.95 14.2,11.75 15.9,10.05 20.65,10.05 21.8,11.2 21.8,13.1 22.1,13.4 22.9,13.4 v22.95,13.45
SWDCLK  (via drill 0.2)
  Top 0.2: U5.8 6.52,24.32 v6.65,24.46 | v24.55,21.41 24.02,21.41 U$1.25
  Bottom 0.2: v6.65,24.46 6.85,24.26 6.88,24.26 12.85,18.29 12.85,11.35 15.45,8.75 21.75,8.75 24.85,11.85 24.85,21.11 v24.55,21.41
SWDIO  (via drill 0.2)
  Top 0.2: U5.9 6.53,23.82 v6.65,23.7 | v23.82,21.97 23.27,21.42 23.26,21.42 23.05,21.2 U$1.26
  Bottom 0.2: v6.65,23.7 12.4,17.95 12.4,11.25 15.3,8.35 21.95,8.35 25.2,11.6 25.2,21.55 24.78,21.97 v23.82,21.97
SWO  (via drill 0.2)
  Top 0.2: U5.6 4.22,25.32 4.18,25.36 3.92,25.36 v3.72,25.56 | v26.11,18.15 25.6,18.15 24.91,18.84 U$1.21
  Bottom 0.2: v3.72,25.56 3.3,25.14 3.3,24.45 11.45,16.3 11.45,10.8 14.75,7.5 22.2,7.5 25.91,11.21 25.91,17.95 v26.11,18.15
TX  (via drill 0.2)
  Top 0.2: U5.3 6.5,26.82 v6.55,26.77 | v22.36,12.8 22.36,13.84 21.85,14.35 U$1.8
  Bottom 0.2: v6.55,26.77 6.75,26.56 6.83,26.56 13.7,19.7 13.7,11.65 15.85,9.5 20.7,9.5 22.36,11.16 v22.36,12.8
VCC
  pour Top: 9,18.1 10.9,16.2 10.9,11.5 9.4,11.5 9.4,12.4 9.8,12.8 9.8,14.1 9.6,14.3 6.4,14.3 6.2,14.1 6.2,12.5 6.8,11.9 6.8,11.5 6.3,11.5 6.1,11.3 6.1,10.8 5.2,10.8 4.7,11.3 4.7,14 5.5,14.8 6,14.8 8,16.8 8,18 8.1,18.1
VDD  (via drill 0.2, 0.3, 0.35)
  Top 0.2: U5.2 6.04,27.33 6.31,27.6 v7.45,27.6 | U$1.13 25.07,15.64 25.26,15.46 25.26,15.41 C19.1 | R1.2 26.55,19.75 v27.1,19.75 | 18.3,15.59 U$1.48
  Top 0.254: C39.1 16.9,14.9 v17.9,14.9 18.3,15.3 18.3,15.59 | U$1.36 18.24,20.84 v18.1,20.7 17.3,20.7 C6.2 17.2,20.16 RN1.8 RN1.1 15.3,20.21 15.3,20.7 15.15,20.85 13.92,20.85 13.66,20.59 13.66,20.14 D1.1 | 26.54,15.4 v26.51,15.43 26.49,15.41 C37.1 26.97,14.83 | 26.92,14.88 27.44,15.4 v27.5,15.4
  Top 0.305: C19.1 25.7,15.34 26.07,14.97 | 25.87,14.97 C37.1 | 27.55,14.5 27.6,14.5 27.78,14.5 C36.1
  Top 0.61: C19.1 26.47,15.34 26.54,15.4 | v26.51,15.43 26.55,15.4 27.25,15.4 | 27.25,15.4 27.44,15.4 | 25.87,14.97 26.07,14.97 26.83,14.97 26.92,14.88 26.97,14.83 | 27.55,14.5 27.4,14.35 C37.1 26.49,14.42 25.77,15.14 25.57,15.14 25.26,15.46 | 27.25,15.4 27.25,14.85 27.6,14.5 | v27.5,15.4 27.89,15.01 C36.1
  other vias: 9.55,1.45 10.65,1.6 10.8,4.4 10.75,3.5 11.55,5.1 12.25,5.6 4.9,6.6 4.3,5.85 4.7,5.1 5.2,4.3 3.6,5.15 4.15,4.3 3.2,4.3 2.25,3.95 5.1,1.3 5.2,2.45 5.35,3.4 6.15,4.1 7.1,4.1 8.05,4.1 9,4.1 9.95,4.2 9.9,3.25 9.15,2.35 10.1,2.4 9,3.2
  pour Top: 1.9,0.4 1.3,1 1.3,3.6 3.7,6 3.7,8.2 3.9,8.4 4.5,8.4 5.2,7.7 6.8,7.7 6.8,6.6 6.3,6.1 6.3,4.8 6.5,4.6 9.8,4.6 10,4.8 10,6.5 9.4,7.1 9.4,7.8 11,7.8 11,6.9 11.2,6.7 12.2,6.7 12.7,6.2 12.7,4.9 11.2,3.4 11.2,1 10.6,0.4
  pour Route15: -0.65,20 43.6,20 43.6,-0.95 -0.65,-0.95
  pour Route15: 19.9,19.85 8.8,30.95 0.15,30.95 0.15,18.85 0.5,18.5 18.55,18.5
VIN
  pour Top: 4.1,15.4 1.4,15.4 1.3,15.5 1.1,15.7 1.1,17.7 1.4,18 1.5,18.1 6,18.1 6,15.4